# Altium schematic sheet ZynqEMIO.SchDoc: =TITLE
size A3; DocumentNumber: 5; SheetNumber: 5; SheetTotal: 11
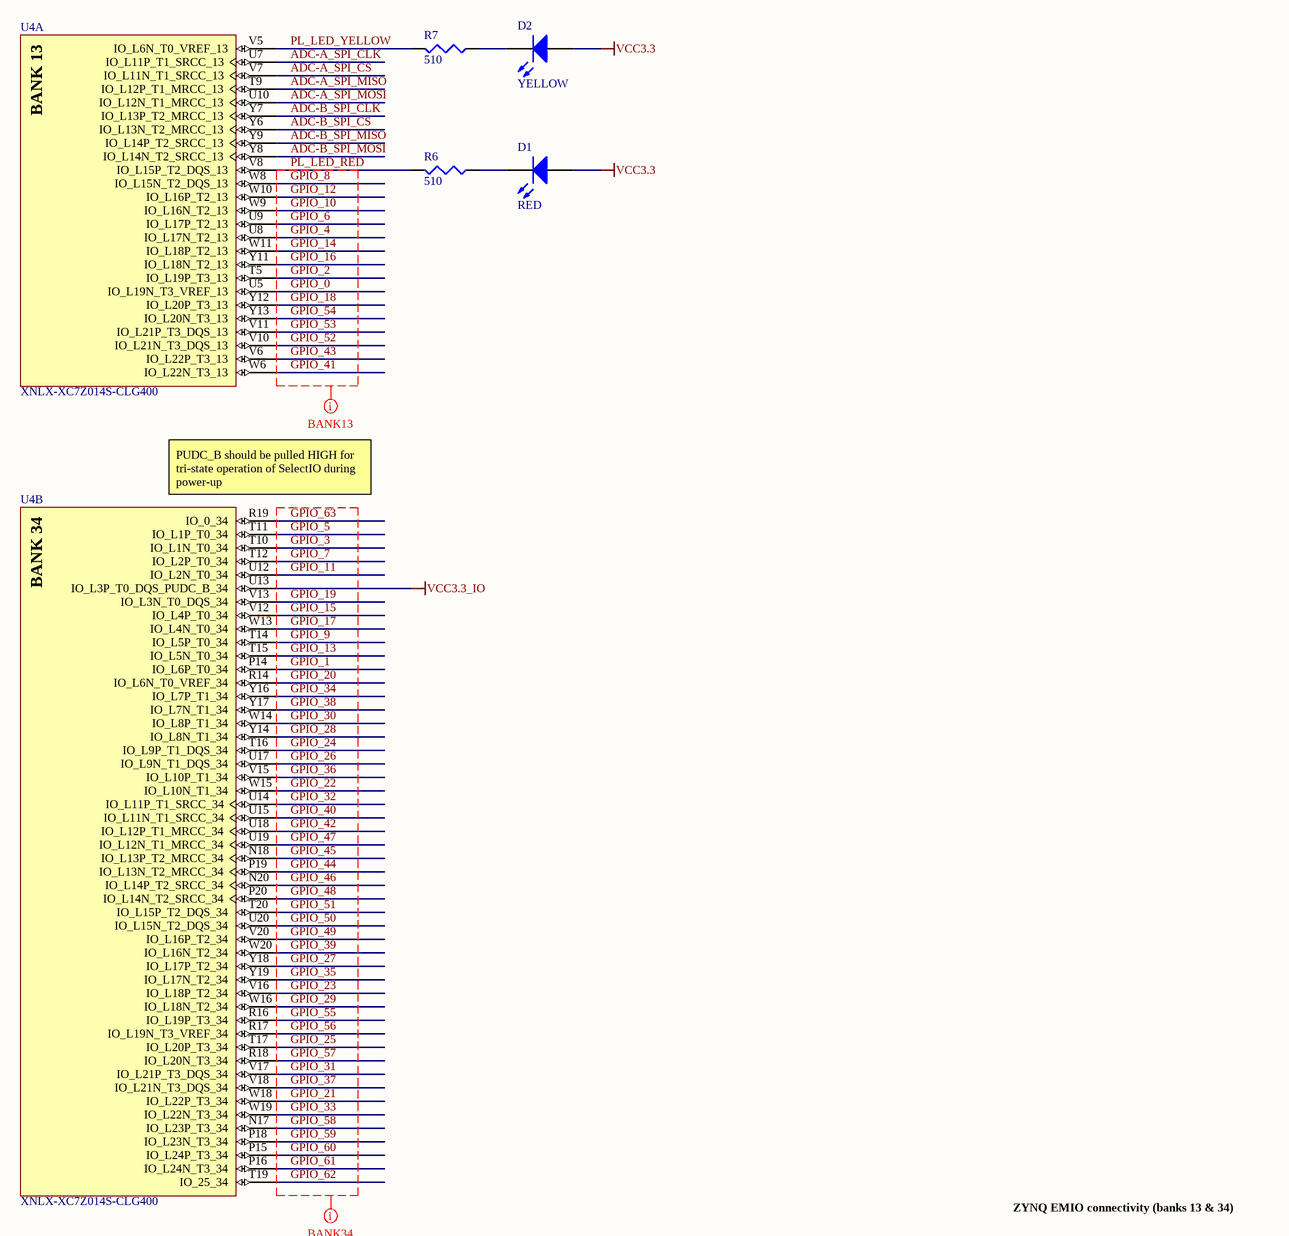
[diagram p0: ZynqEMIO.SchDoc]

## Parts
D1  value RED  [LED0603_M]  (hidden comment: ?)
D2  value YELLOW  [LED0603_M]  (hidden comment: ?)
R6  value 510  [R0402_IPC_H]  (hidden comment: ?)
R7  value 510  [R0402_IPC_H]  (hidden comment: ?)
U4  XNLX-XC7Z014S-CLG400  [CLG400]  (parts A,B of 9)

## Nets
VCC3.3: D1.1(A) D2.1(A)
VCC3.3_IO: U4.U13(IO_L3P_T0_DQS_PUDC_B_34)
~{ADC-A_SPI_CS}: U4.V7(IO_L11N_T1_SRCC_13)
~{ADC-B_SPI_CS}: U4.Y6(IO_L13N_T2_MRCC_13)
ADC-A_SPI_CLK: U4.U7(IO_L11P_T1_SRCC_13)
ADC-A_SPI_MISO: U4.T9(IO_L12P_T1_MRCC_13)
ADC-A_SPI_MOSI: U4.U10(IO_L12N_T1_MRCC_13)
ADC-B_SPI_CLK: U4.Y7(IO_L13P_T2_MRCC_13)
ADC-B_SPI_MISO: U4.Y9(IO_L14P_T2_SRCC_13)
ADC-B_SPI_MOSI: U4.Y8(IO_L14N_T2_SRCC_13)
GPIO_0: U4.U5(IO_L19N_T3_VREF_13)
GPIO_1: U4.P14(IO_L6P_T0_34)
GPIO_2: U4.T5(IO_L19P_T3_13)
GPIO_3: U4.T10(IO_L1N_T0_34)
GPIO_4: U4.U8(IO_L17N_T2_13)
GPIO_5: U4.T11(IO_L1P_T0_34)
GPIO_6: U4.U9(IO_L17P_T2_13)
GPIO_7: U4.T12(IO_L2P_T0_34)
GPIO_8: U4.W8(IO_L15N_T2_DQS_13)
GPIO_9: U4.T14(IO_L5P_T0_34)
GPIO_10: U4.W9(IO_L16N_T2_13)
GPIO_11: U4.U12(IO_L2N_T0_34)
GPIO_12: U4.W10(IO_L16P_T2_13)
GPIO_13: U4.T15(IO_L5N_T0_34)
GPIO_14: U4.W11(IO_L18P_T2_13)
GPIO_15: U4.V12(IO_L4P_T0_34)
GPIO_16: U4.Y11(IO_L18N_T2_13)
GPIO_17: U4.W13(IO_L4N_T0_34)
GPIO_18: U4.Y12(IO_L20P_T3_13)
GPIO_19: U4.V13(IO_L3N_T0_DQS_34)
GPIO_20: U4.R14(IO_L6N_T0_VREF_34)
GPIO_21: U4.W18(IO_L22P_T3_34)
GPIO_22: U4.W15(IO_L10N_T1_34)
GPIO_23: U4.V16(IO_L18P_T2_34)
GPIO_24: U4.T16(IO_L9P_T1_DQS_34)
GPIO_25: U4.T17(IO_L20P_T3_34)
GPIO_26: U4.U17(IO_L9N_T1_DQS_34)
GPIO_27: U4.Y18(IO_L17P_T2_34)
GPIO_28: U4.Y14(IO_L8N_T1_34)
GPIO_29: U4.W16(IO_L18N_T2_34)
GPIO_30: U4.W14(IO_L8P_T1_34)
GPIO_31: U4.V17(IO_L21P_T3_DQS_34)
GPIO_32: U4.U14(IO_L11P_T1_SRCC_34)
GPIO_33: U4.W19(IO_L22N_T3_34)
GPIO_34: U4.Y16(IO_L7P_T1_34)
GPIO_35: U4.Y19(IO_L17N_T2_34)
GPIO_36: U4.V15(IO_L10P_T1_34)
GPIO_37: U4.V18(IO_L21N_T3_DQS_34)
GPIO_38: U4.Y17(IO_L7N_T1_34)
GPIO_39: U4.W20(IO_L16N_T2_34)
GPIO_40: U4.U15(IO_L11N_T1_SRCC_34)
GPIO_41: U4.W6(IO_L22N_T3_13)
GPIO_42: U4.U18(IO_L12P_T1_MRCC_34)
GPIO_43: U4.V6(IO_L22P_T3_13)
GPIO_44: U4.P19(IO_L13N_T2_MRCC_34)
GPIO_45: U4.N18(IO_L13P_T2_MRCC_34)
GPIO_46: U4.N20(IO_L14P_T2_SRCC_34)
GPIO_47: U4.U19(IO_L12N_T1_MRCC_34)
GPIO_48: U4.P20(IO_L14N_T2_SRCC_34)
GPIO_49: U4.V20(IO_L16P_T2_34)
GPIO_50: U4.U20(IO_L15N_T2_DQS_34)
GPIO_51: U4.T20(IO_L15P_T2_DQS_34)
GPIO_52: U4.V10(IO_L21N_T3_DQS_13)
GPIO_53: U4.V11(IO_L21P_T3_DQS_13)
GPIO_54: U4.Y13(IO_L20N_T3_13)
GPIO_55: U4.R16(IO_L19P_T3_34)
GPIO_56: U4.R17(IO_L19N_T3_VREF_34)
GPIO_57: U4.R18(IO_L20N_T3_34)
GPIO_58: U4.N17(IO_L23P_T3_34)
GPIO_59: U4.P18(IO_L23N_T3_34)
GPIO_60: U4.P15(IO_L24P_T3_34)
GPIO_61: U4.P16(IO_L24N_T3_34)
GPIO_62: U4.T19(IO_25_34)
GPIO_63: U4.R19(IO_0_34)
PL_LED_RED: R6.2 U4.V8(IO_L15P_T2_DQS_13)
PL_LED_YELLOW: R7.2 U4.V5(IO_L6N_T0_VREF_13)
NetD1_2: D1.2(K) R6.1
NetD2_2: D2.2(K) R7.1

## Layout directives
net class BANK13: GPIO_0, GPIO_2, GPIO_4, GPIO_6, GPIO_8, GPIO_10, GPIO_12, GPIO_14, GPIO_16, GPIO_18, GPIO_41, GPIO_43, GPIO_52, GPIO_53, GPIO_54, PL_LED_RED
net class BANK34: GPIO_1, GPIO_3, GPIO_5, GPIO_7, GPIO_9, GPIO_11, GPIO_13, GPIO_15, GPIO_17, GPIO_19, GPIO_20, GPIO_21, GPIO_22, GPIO_23, GPIO_24, GPIO_25, GPIO_26, GPIO_27, GPIO_28, GPIO_29, GPIO_30, GPIO_31, GPIO_32, GPIO_33, GPIO_34, GPIO_35, GPIO_36, GPIO_37, GPIO_38, GPIO_39, GPIO_40, GPIO_42, GPIO_44, GPIO_45, GPIO_46, GPIO_47, GPIO_48, GPIO_49, GPIO_50, GPIO_51, GPIO_55, GPIO_56, GPIO_57, GPIO_58, GPIO_59, GPIO_60, GPIO_61, GPIO_62, GPIO_63

## Notes on the sheet
- (near U4) PUDC_B should be pulled HIGH for tri-state operation of SelectIO during power-up
- ZYNQ EMIO connectivity (banks 13 & 34)
- Description
- Title
- Size:
- Date:
- A3
- Number:
- Time:
- Revision:
- Sheet
- of
- File:
- Author:
- (in symbol XNLX-XC7Z020-CLG400, part A) BANK 13
- (in symbol XNLX-XC7Z020-CLG400, part B) BANK 34

## Library data of the parts
D1 = LED: Light Emitting Diode; Manufacturer: Lite-On; Part: LTST-C190KRKT; INVKEY: LED-RD-TOP-0603
D2 = LED: Light Emitting Diode; Manufacturer: Lite-On; Part: LTST-C190KSKT; INVKEY: LED-YLW-TOP-0603
R6 R7 = Res: Resistor; Manufacturer: Panasonic-ECG; Part: ERJ-2RKF5100X; Tolerance: 1%; INVKEY: RS0402-510R-1/10W-1%; PackageDescription: Chip Resistor
U4 = XNLX-XC7Z020-CLG400: Manufacturer: Xilinx; Part: XC7Z014S-1CLG400C; INVKEY: ?